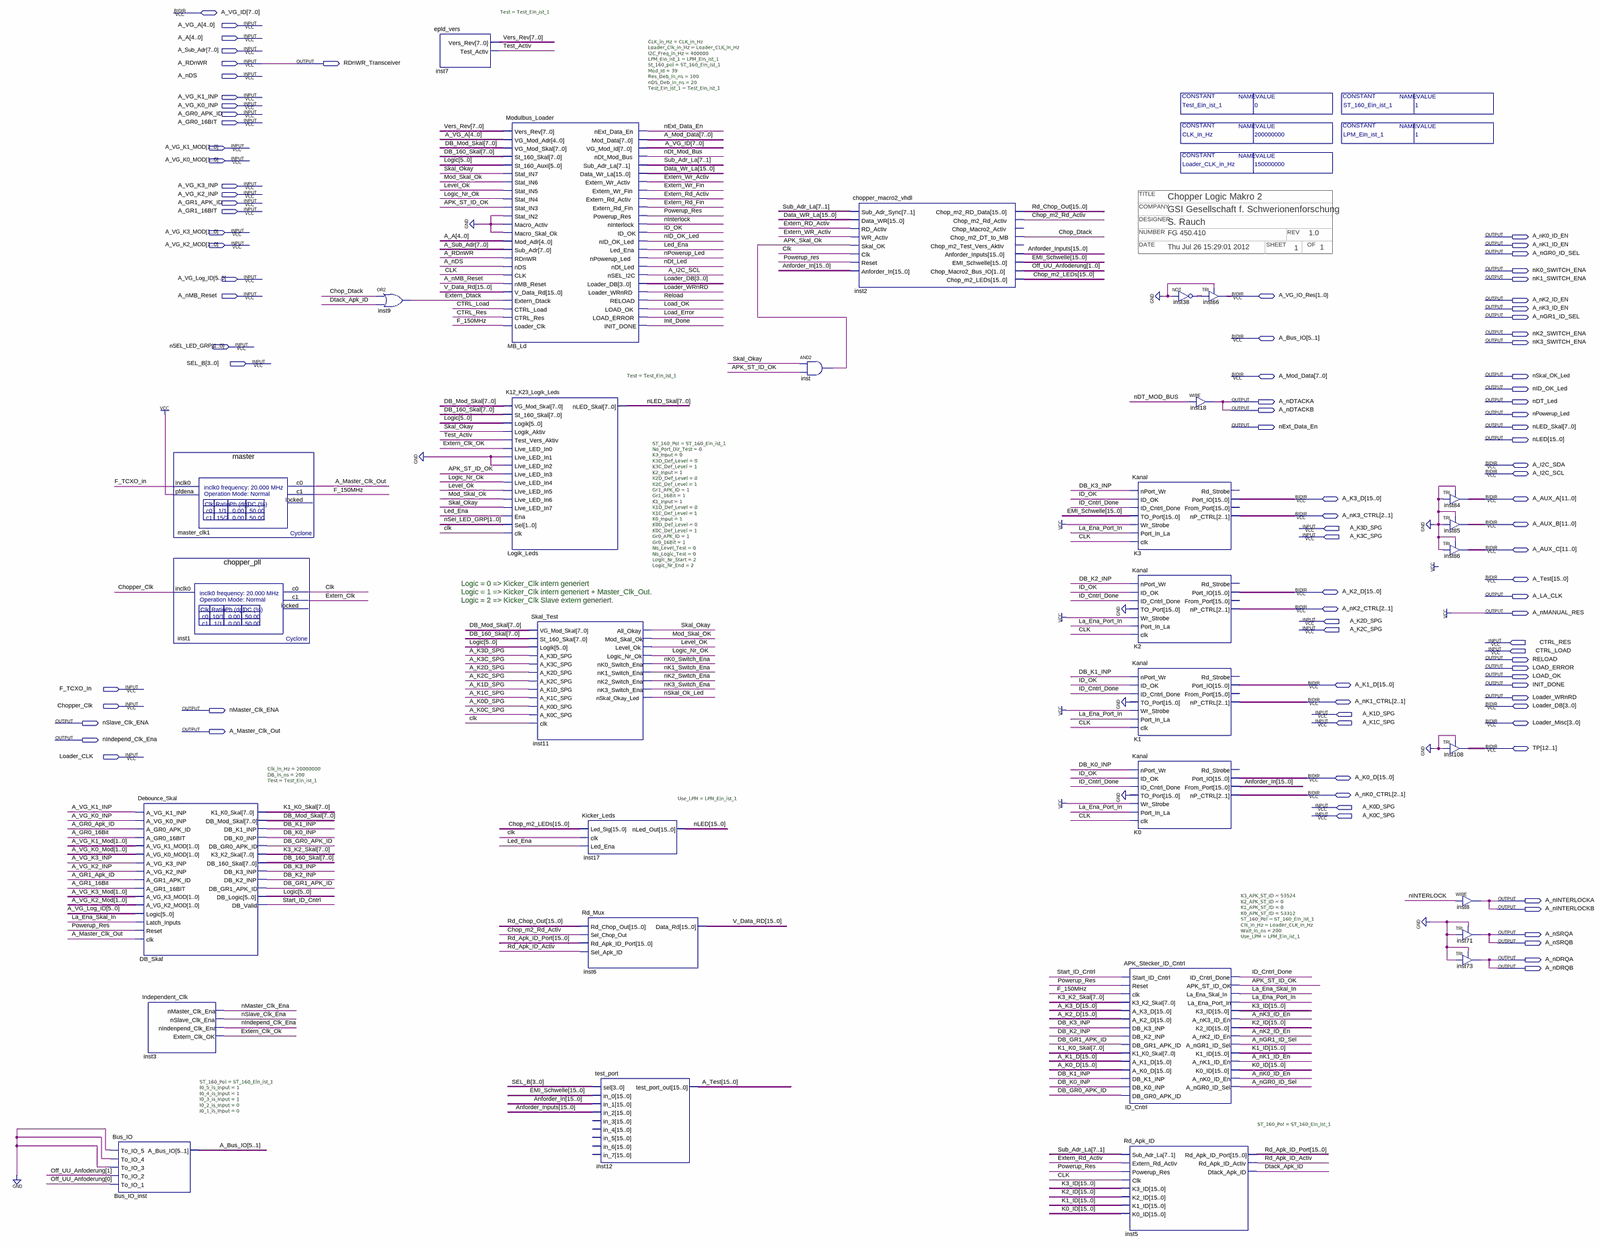
[diagram p0: schematic sheet, whole]
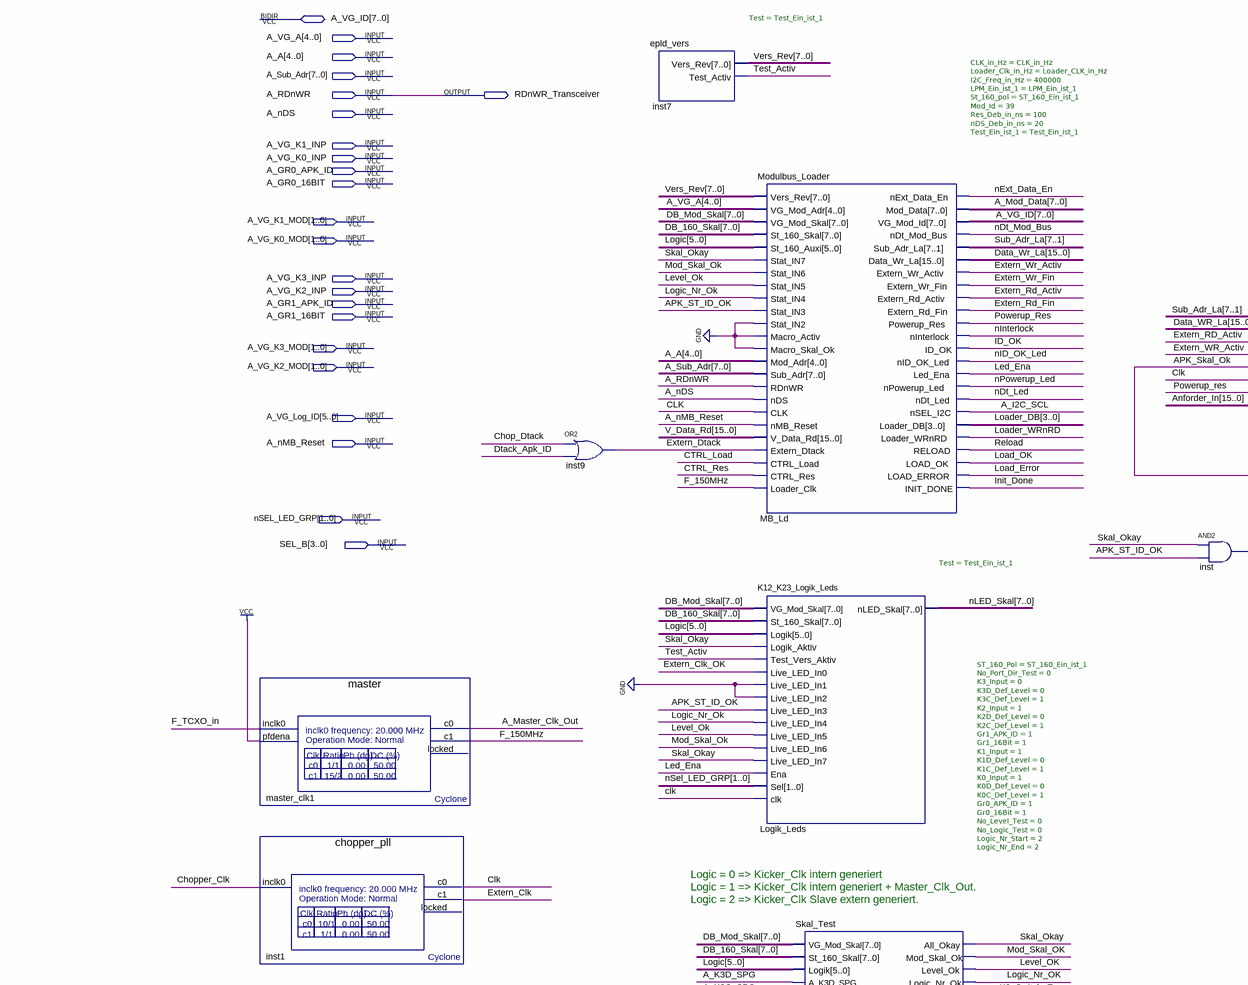
[diagram p1: schematic sheet, upper left part]
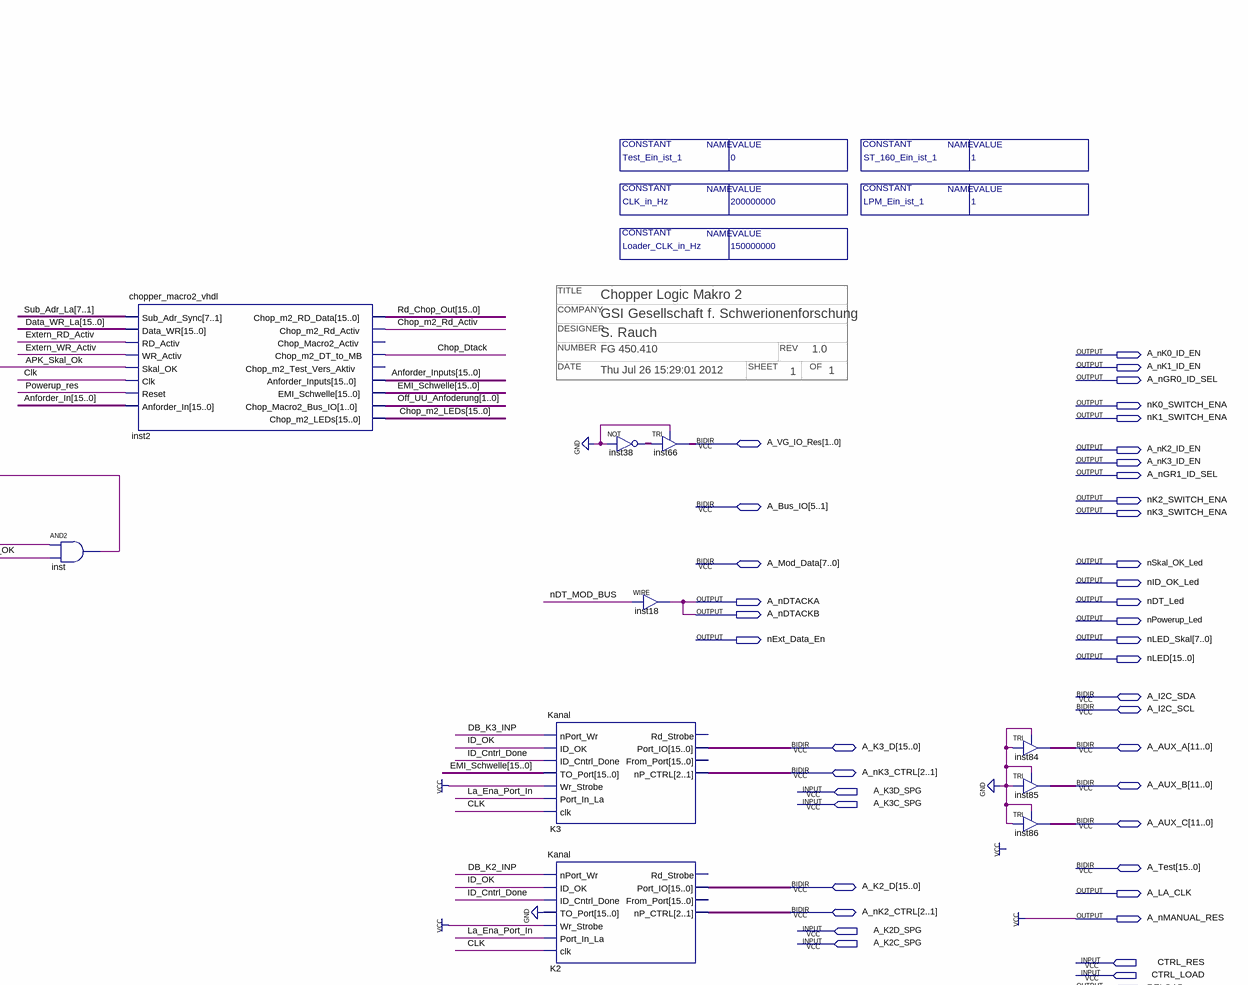
[diagram p2: schematic sheet, upper right part]
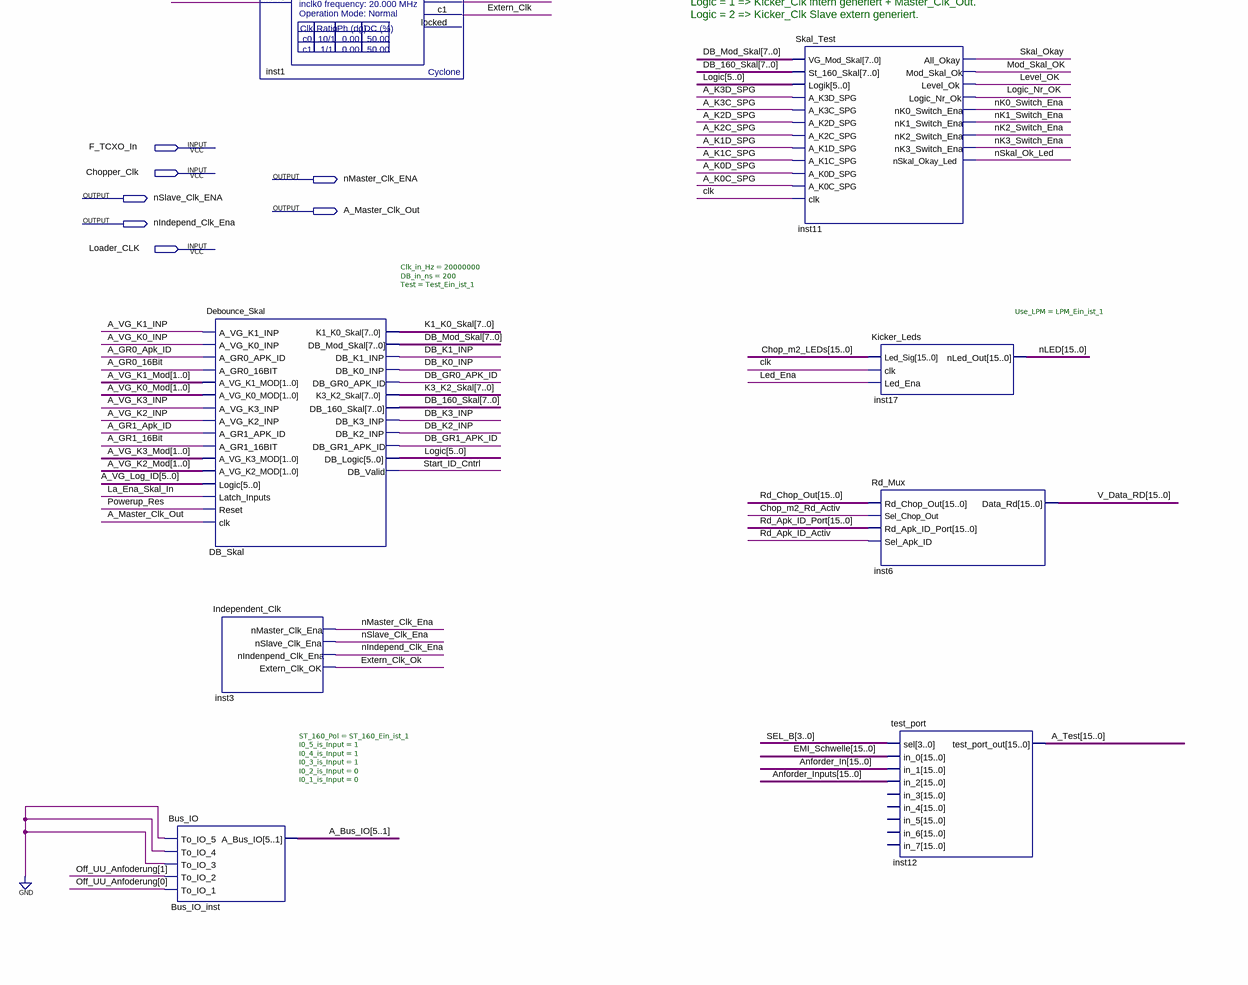
[diagram p3: schematic sheet, lower left part]
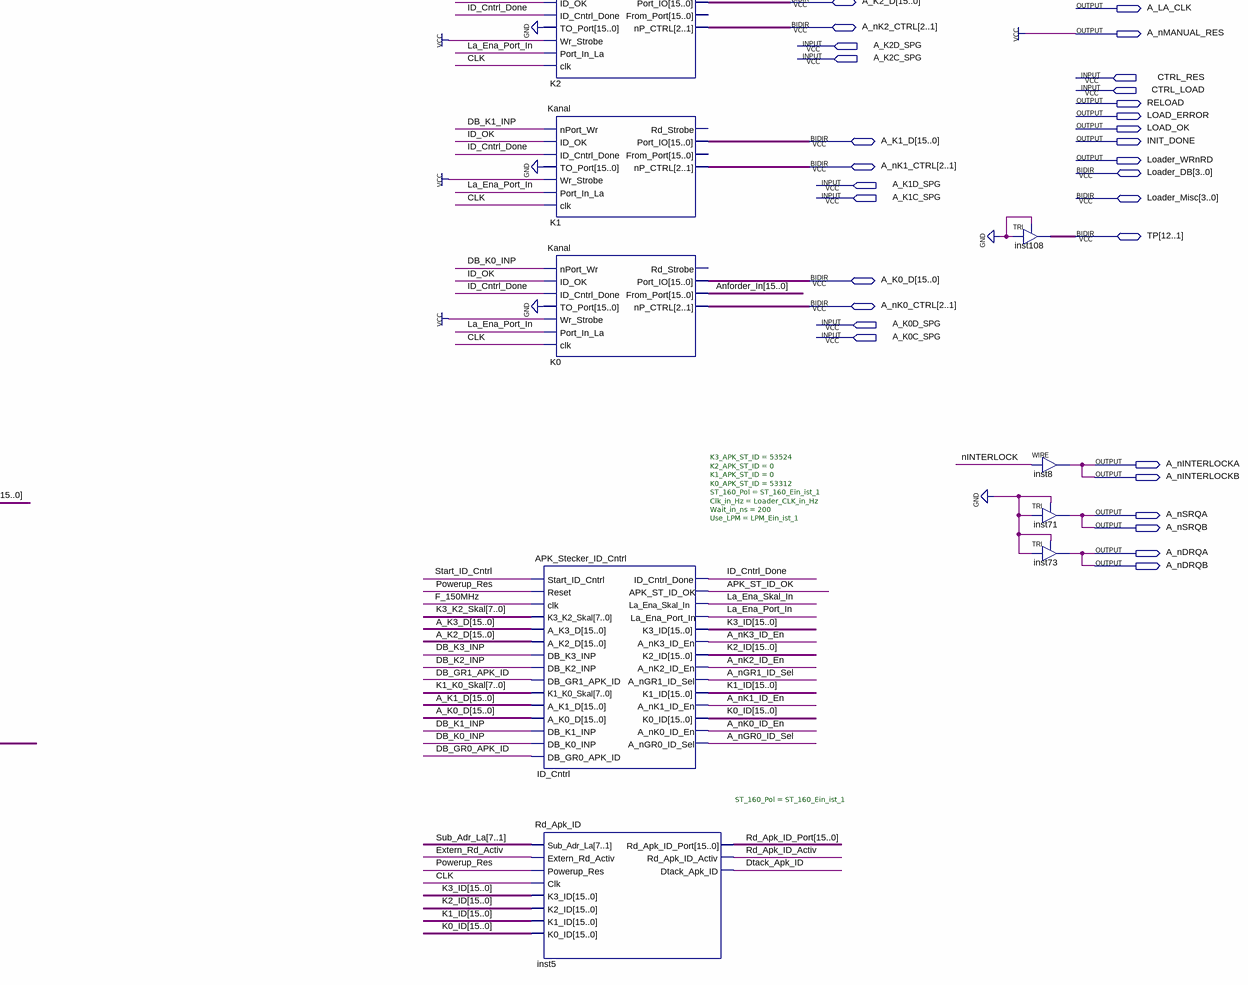
[diagram p4: schematic sheet, lower right part]
// Quartus schematic chopper_m2.bdf as structural Verilog: 31 symbols, 92 pins
// Title block: TITLE: Chopper Logic Makro 2; COMPANY: GSI Gesellschaft f. Schwerionenforschung; DESIGNER: S. Rauch; NUMBER: FG 450.410; REV: 1.0; DATE: Thu Jul 26 15:29:01 2012; SHEET: 1; OF: 1
module chopper_m2 #(parameter LPM_Ein_ist_1 = 1, parameter ST_160_Ein_ist_1 = 1, parameter Loader_CLK_in_Hz = 150000000, parameter CLK_in_Hz = 200000000, parameter Test_Ein_ist_1 = 0) (
  input  [4:0] A_VG_A,
  input  [4:0] A_A,
  input  [7:0] A_Sub_Adr,
  input  A_RDnWR,
  input  A_nDS,
  input  A_VG_K1_INP,
  input  A_VG_K0_INP,
  input  A_GR0_APK_ID,
  input  A_GR0_16BIT,
  input  [1:0] A_VG_K1_MOD,
  input  [1:0] A_VG_K0_MOD,
  input  A_VG_K3_INP,
  input  A_VG_K2_INP,
  input  A_GR1_APK_ID,
  input  A_GR1_16BIT,
  input  [1:0] A_VG_K3_MOD,
  input  [1:0] A_VG_K2_MOD,
  input  [5:0] A_VG_Log_ID,
  input  A_nMB_Reset,
  input  [1:0] nSEL_LED_GRP,
  input  [3:0] SEL_B,
  input  A_K3D_SPG,
  input  A_K3C_SPG,
  input  A_K2D_SPG,
  input  A_K2C_SPG,
  input  CTRL_RES,
  input  CTRL_LOAD,
  input  F_TCXO_In,
  input  Chopper_Clk,
  input  A_K1D_SPG,
  input  A_K1C_SPG,
  input  Loader_CLK,
  input  A_K0D_SPG,
  input  A_K0C_SPG,
  inout  [7:0] A_VG_ID,
  inout  [1:0] A_VG_IO_Res,
  inout  [5:1] A_Bus_IO,
  inout  [7:0] A_Mod_Data,
  inout  A_I2C_SDA,
  inout  A_I2C_SCL,
  inout  [15:0] A_K3_D,
  inout  [11:0] A_AUX_A,
  inout  [2:1] A_nK3_CTRL,
  inout  [11:0] A_AUX_B,
  inout  [11:0] A_AUX_C,
  inout  [15:0] A_Test,
  inout  [15:0] A_K2_D,
  inout  [2:1] A_nK2_CTRL,
  inout  [15:0] A_K1_D,
  inout  [2:1] A_nK1_CTRL,
  inout  [3:0] Loader_DB,
  inout  [3:0] Loader_Misc,
  inout  [12:1] TP,
  inout  [15:0] A_K0_D,
  inout  [2:1] A_nK0_CTRL,
  output RDnWR_Transceiver,
  output A_nK0_ID_EN,
  output A_nK1_ID_EN,
  output A_nGR0_ID_SEL,
  output nK0_SWITCH_ENA,
  output nK1_SWITCH_ENA,
  output A_nK2_ID_EN,
  output A_nK3_ID_EN,
  output A_nGR1_ID_SEL,
  output nK2_SWITCH_ENA,
  output nK3_SWITCH_ENA,
  output nSkal_OK_Led,
  output nID_OK_Led,
  output A_nDTACKA,
  output nDT_Led,
  output A_nDTACKB,
  output nPowerup_Led,
  output nExt_Data_En,
  output [7:0] nLED_Skal,
  output [15:0] nLED,
  output A_LA_CLK,
  output A_nMANUAL_RES,
  output RELOAD,
  output LOAD_ERROR,
  output LOAD_OK,
  output INIT_DONE,
  output Loader_WRnRD,
  output nMaster_Clk_ENA,
  output nSlave_Clk_ENA,
  output A_Master_Clk_Out,
  output nIndepend_Clk_Ena,
  output A_nINTERLOCKA,
  output A_nINTERLOCKB,
  output A_nSRQA,
  output A_nSRQB,
  output A_nDRQA,
  output A_nDRQB
);

  wire APK_Skal_Ok, APK_ST_ID_OK, Chop_Dtack, Chop_m2_Rd_Activ, CLK, DB_GR0_APK_ID, DB_GR1_APK_ID, DB_K0_INP,
       DB_K1_INP, DB_K2_INP, DB_K3_INP, Dtack_Apk_ID, Extern_Clk, Extern_Clk_OK, Extern_Dtack,
       Extern_Rd_Activ, Extern_Rd_Fin, Extern_Wr_Activ, Extern_Wr_Fin, F_150MHz, ID_Cntrl_Done, ID_OK,
       La_Ena_Port_In, La_Ena_Skal_In, Led_Ena, Level_Ok, Logic_Nr_Ok, Mod_Skal_Ok, nDt_Mod_Bus, nInterlock,
       Powerup_Res, Rd_Apk_ID_Activ, Skal_Okay, Start_ID_Cntrl, Test_Activ;
  wire [1:0] inst38_out, Off_UU_Anfoderung;
  wire [5:0] Logic;
  wire [7:0] DB_160_Skal, DB_Mod_Skal, K1_K0_Skal, K3_K2_Skal, Vers_Rev;
  wire [7:1] Sub_Adr_La;
  wire [15:0] Anforder_In, Anforder_Inputs, Chop_m2_LEDs, Data_Wr_La, EMI_Schwelle, K0_ID, K1_ID, K2_ID,
       K3_ID, Rd_Apk_ID_Port, Rd_Chop_Out, V_Data_Rd;

  Debounce_Skal #(.Clk_in_Hz(20000000), .DB_in_ns(200), .Test(Test_Ein_ist_1)) DB_Skal (
    .A_VG_K1_INP(A_VG_K1_INP), .A_VG_K0_INP(A_VG_K0_INP), .A_GR0_APK_ID(A_GR0_APK_ID),
    .A_GR0_16BIT(A_GR0_16BIT), .A_VG_K1_MOD(A_VG_K1_MOD), .A_VG_K0_MOD(A_VG_K0_MOD),
    .A_VG_K3_INP(A_VG_K3_INP), .A_VG_K2_INP(A_VG_K2_INP), .A_GR1_APK_ID(A_GR1_APK_ID),
    .A_GR1_16BIT(A_GR1_16BIT), .A_VG_K3_MOD(A_VG_K3_MOD), .A_VG_K2_MOD(A_VG_K2_MOD), .Logic(A_VG_Log_ID),
    .Latch_Inputs(La_Ena_Skal_In), .Reset(Powerup_Res), .clk(A_Master_Clk_Out), .K1_K0_Skal(K1_K0_Skal),
    .DB_Mod_Skal(DB_Mod_Skal), .DB_K1_INP(DB_K1_INP), .DB_K0_INP(DB_K0_INP), .DB_GR0_APK_ID(DB_GR0_APK_ID),
    .K3_K2_Skal(K3_K2_Skal), .DB_160_Skal(DB_160_Skal), .DB_K3_INP(DB_K3_INP), .DB_K2_INP(DB_K2_INP),
    .DB_GR1_APK_ID(DB_GR1_APK_ID), .DB_Logic(Logic), .DB_Valid(Start_ID_Cntrl));
  Independent_Clk inst3 (
    .nMaster_Clk_Ena(nMaster_Clk_ENA), .nSlave_Clk_Ena(nSlave_Clk_ENA),
    .nIndenpend_Clk_Ena(nIndepend_Clk_Ena), .Extern_Clk_OK(Extern_Clk_OK));
  Bus_IO #(.ST_160_Pol(ST_160_Ein_ist_1), .I0_5_is_Input(1), .I0_4_is_Input(1), .I0_3_is_Input(1), .I0_2_is_Input(0), .I0_1_is_Input(0)) Bus_IO_inst (
    .To_IO_5(1'b0), .To_IO_4(1'b0), .To_IO_3(1'b0), .To_IO_2(Off_UU_Anfoderung[1]),
    .To_IO_1(Off_UU_Anfoderung[0]), .A_Bus_IO(A_Bus_IO));
  master master_clk1 (.inclk0(F_TCXO_In), .pfdena(1'b1), .c0(A_Master_Clk_Out), .c1(F_150MHz));  // open: locked
  chopper_pll inst1 (.inclk0(Chopper_Clk), .c0(CLK), .c1(Extern_Clk));  // open: locked
  or inst9 (Extern_Dtack, Chop_Dtack, Dtack_Apk_ID);
  epld_vers #(.Test(Test_Ein_ist_1)) inst7 (.Vers_Rev(Vers_Rev), .Test_Activ(Test_Activ));
  Modulbus_Loader #(.CLK_in_Hz(CLK_in_Hz), .Loader_Clk_in_Hz(Loader_CLK_in_Hz), .I2C_Freq_in_Hz(400000), .LPM_Ein_ist_1(LPM_Ein_ist_1), .St_160_pol(ST_160_Ein_ist_1), .Mod_Id(39), .Res_Deb_in_ns(100), .nDS_Deb_in_ns(20), .Test_Ein_ist_1(Test_Ein_ist_1)) MB_Ld (
    .Vers_Rev(Vers_Rev), .VG_Mod_Adr(A_VG_A), .VG_Mod_Skal(DB_Mod_Skal), .St_160_Skal(DB_160_Skal),
    .St_160_Auxi(Logic), .Stat_IN7(Skal_Okay), .Stat_IN6(Mod_Skal_Ok), .Stat_IN5(Level_Ok),
    .Stat_IN4(Logic_Nr_Ok), .Stat_IN3(APK_ST_ID_OK), .Stat_IN2(1'b0), .Macro_Activ(1'b0),
    .Macro_Skal_Ok(1'b0), .Mod_Adr(A_A), .Sub_Adr(A_Sub_Adr), .RDnWR(A_RDnWR), .nDS(A_nDS), .CLK(CLK),
    .nMB_Reset(A_nMB_Reset), .V_Data_Rd(V_Data_Rd), .Extern_Dtack(Extern_Dtack), .CTRL_Load(CTRL_LOAD),
    .CTRL_Res(CTRL_RES), .Loader_Clk(F_150MHz), .nExt_Data_En(nExt_Data_En), .nDt_Mod_Bus(nDt_Mod_Bus),
    .Sub_Adr_La(Sub_Adr_La), .Data_Wr_La(Data_Wr_La), .Extern_Wr_Activ(Extern_Wr_Activ),
    .Extern_Wr_Fin(Extern_Wr_Fin), .Extern_Rd_Activ(Extern_Rd_Activ), .Extern_Rd_Fin(Extern_Rd_Fin),
    .Powerup_Res(Powerup_Res), .nInterlock(nInterlock), .ID_OK(ID_OK), .nID_OK_Led(nID_OK_Led),
    .Led_Ena(Led_Ena), .nPowerup_Led(nPowerup_Led), .nDt_Led(nDT_Led), .nSEL_I2C(A_I2C_SCL),
    .Loader_WRnRD(Loader_WRnRD), .RELOAD(RELOAD), .LOAD_OK(LOAD_OK), .LOAD_ERROR(LOAD_ERROR),
    .INIT_DONE(INIT_DONE), .Mod_Data(A_Mod_Data), .VG_Mod_Id(A_VG_ID), .Loader_DB(Loader_DB));
  K12_K23_Logik_Leds #(.Test(Test_Ein_ist_1)) Logik_Leds (
    .VG_Mod_Skal(DB_Mod_Skal), .St_160_Skal(DB_160_Skal), .Logik(Logic), .Logik_Aktiv(Skal_Okay),
    .Test_Vers_Aktiv(Test_Activ), .Live_LED_In0(Extern_Clk_OK), .Live_LED_In1(1'b0), .Live_LED_In2(1'b0),
    .Live_LED_In3(APK_ST_ID_OK), .Live_LED_In4(Logic_Nr_Ok), .Live_LED_In5(Level_Ok),
    .Live_LED_In6(Mod_Skal_Ok), .Live_LED_In7(Skal_Okay), .Ena(Led_Ena), .Sel(nSEL_LED_GRP), .clk(CLK),
    .nLED_Skal(nLED_Skal));
  Skal_Test #(.ST_160_Pol(ST_160_Ein_ist_1), .No_Port_Dir_Test(0), .K3_Input(0), .K3D_Def_Level(0), .K3C_Def_Level(1), .K2_Input(1), .K2D_Def_Level(0), .K2C_Def_Level(1), .Gr1_APK_ID(1), .Gr1_16Bit(1), .K1_Input(1), .K1D_Def_Level(0), .K1C_Def_Level(1), .K0_Input(1), .K0D_Def_Level(0), .K0C_Def_Level(1), .Gr0_APK_ID(1), .Gr0_16Bit(1), .No_Level_Test(0), .No_Logic_Test(0), .Logic_Nr_Start(2), .Logic_Nr_End(2)) inst11 (
    .VG_Mod_Skal(DB_Mod_Skal), .St_160_Skal(DB_160_Skal), .Logik(Logic), .A_K3D_SPG(A_K3D_SPG),
    .A_K3C_SPG(A_K3C_SPG), .A_K2D_SPG(A_K2D_SPG), .A_K2C_SPG(A_K2C_SPG), .A_K1D_SPG(A_K1D_SPG),
    .A_K1C_SPG(A_K1C_SPG), .A_K0D_SPG(A_K0D_SPG), .A_K0C_SPG(A_K0C_SPG), .clk(CLK), .All_Okay(Skal_Okay),
    .Mod_Skal_Ok(Mod_Skal_Ok), .Level_Ok(Level_Ok), .Logic_Nr_Ok(Logic_Nr_Ok),
    .nK0_Switch_Ena(nK0_SWITCH_ENA), .nK1_Switch_Ena(nK1_SWITCH_ENA), .nK2_Switch_Ena(nK2_SWITCH_ENA),
    .nK3_Switch_Ena(nK3_SWITCH_ENA), .nSkal_Okay_Led(nSkal_OK_Led));
  Kicker_Leds #(.Use_LPM(LPM_Ein_ist_1)) inst17 (.Led_Sig(Chop_m2_LEDs), .clk(CLK), .Led_Ena(Led_Ena), .nLed_Out(nLED));
  Rd_Mux inst6 (
    .Rd_Chop_Out(Rd_Chop_Out), .Sel_Chop_Out(Chop_m2_Rd_Activ), .Rd_Apk_ID_Port(Rd_Apk_ID_Port),
    .Sel_Apk_ID(Rd_Apk_ID_Activ), .Data_Rd(V_Data_Rd));
  test_port inst12 (
    .sel(SEL_B), .in_0(EMI_Schwelle), .in_1(Anforder_In), .in_2(Anforder_Inputs), .test_port_out(A_Test));  // open: in_3, in_4, in_5, in_6, in_7
  and inst (APK_Skal_Ok, Skal_Okay, APK_ST_ID_OK);
  chopper_macro2_vhdl inst2 (
    .Sub_Adr_Sync(Sub_Adr_La), .Data_WR(Data_Wr_La), .RD_Activ(Extern_Rd_Activ), .WR_Activ(Extern_Wr_Activ),
    .Skal_OK(APK_Skal_Ok), .Clk(CLK), .Reset(Powerup_Res), .Anforder_In(Anforder_In),
    .Chop_m2_RD_Data(Rd_Chop_Out), .Chop_m2_Rd_Activ(Chop_m2_Rd_Activ), .Chop_m2_DT_to_MB(Chop_Dtack),
    .Anforder_Inputs(Anforder_Inputs), .EMI_Schwelle(EMI_Schwelle), .Chop_Macro2_Bus_IO(Off_UU_Anfoderung),
    .Chop_m2_LEDs(Chop_m2_LEDs));  // open: Chop_Macro2_Activ, Chop_m2_Test_Vers_Aktiv
  APK_Stecker_ID_Cntrl #(.K3_APK_ST_ID(53524), .K2_APK_ST_ID(0), .K1_APK_ST_ID(0), .K0_APK_ST_ID(53312), .ST_160_Pol(ST_160_Ein_ist_1), .Clk_in_Hz(Loader_CLK_in_Hz), .Wait_in_ns(200), .Use_LPM(LPM_Ein_ist_1)) ID_Cntrl (
    .Start_ID_Cntrl(Start_ID_Cntrl), .Reset(Powerup_Res), .clk(F_150MHz), .K3_K2_Skal(K3_K2_Skal),
    .A_K3_D(A_K3_D), .A_K2_D(A_K2_D), .DB_K3_INP(DB_K3_INP), .DB_K2_INP(DB_K2_INP),
    .DB_GR1_APK_ID(DB_GR1_APK_ID), .K1_K0_Skal(K1_K0_Skal), .A_K1_D(A_K1_D), .A_K0_D(A_K0_D),
    .DB_K1_INP(DB_K1_INP), .DB_K0_INP(DB_K0_INP), .DB_GR0_APK_ID(DB_GR0_APK_ID),
    .ID_Cntrl_Done(ID_Cntrl_Done), .APK_ST_ID_OK(APK_ST_ID_OK), .La_Ena_Skal_In(La_Ena_Skal_In),
    .La_Ena_Port_In(La_Ena_Port_In), .K3_ID(K3_ID), .A_nK3_ID_En(A_nK3_ID_EN), .K2_ID(K2_ID),
    .A_nK2_ID_En(A_nK2_ID_EN), .A_nGR1_ID_Sel(A_nGR1_ID_SEL), .K1_ID(K1_ID), .A_nK1_ID_En(A_nK1_ID_EN),
    .K0_ID(K0_ID), .A_nK0_ID_En(A_nK0_ID_EN), .A_nGR0_ID_Sel(A_nGR0_ID_SEL));
  Rd_Apk_ID #(.ST_160_Pol(ST_160_Ein_ist_1)) inst5 (
    .Sub_Adr_La(Sub_Adr_La), .Extern_Rd_Activ(Extern_Rd_Activ), .Powerup_Res(Powerup_Res), .Clk(CLK),
    .K3_ID(K3_ID), .K2_ID(K2_ID), .K1_ID(K1_ID), .K0_ID(K0_ID), .Rd_Apk_ID_Port(Rd_Apk_ID_Port),
    .Rd_Apk_ID_Activ(Rd_Apk_ID_Activ), .Dtack_Apk_ID(Dtack_Apk_ID));
  Kanal K3 (
    .nPort_Wr(DB_K3_INP), .ID_OK(ID_OK), .ID_Cntrl_Done(ID_Cntrl_Done), .TO_Port(EMI_Schwelle),
    .Wr_Strobe(1'b1), .Port_In_La(La_Ena_Port_In), .clk(CLK), .Port_IO(A_K3_D), .nP_CTRL(A_nK3_CTRL));  // open: Rd_Strobe, From_Port
  Kanal K2 (
    .nPort_Wr(DB_K2_INP), .ID_OK(ID_OK), .ID_Cntrl_Done(ID_Cntrl_Done), .TO_Port({16{1'b0}}),
    .Wr_Strobe(1'b1), .Port_In_La(La_Ena_Port_In), .clk(CLK), .Port_IO(A_K2_D), .nP_CTRL(A_nK2_CTRL));  // open: Rd_Strobe, From_Port
  Kanal K1 (
    .nPort_Wr(DB_K1_INP), .ID_OK(ID_OK), .ID_Cntrl_Done(ID_Cntrl_Done), .TO_Port({16{1'b0}}),
    .Wr_Strobe(1'b1), .Port_In_La(La_Ena_Port_In), .clk(CLK), .Port_IO(A_K1_D), .nP_CTRL(A_nK1_CTRL));  // open: Rd_Strobe, From_Port
  Kanal K0 (
    .nPort_Wr(DB_K0_INP), .ID_OK(ID_OK), .ID_Cntrl_Done(ID_Cntrl_Done), .TO_Port({16{1'b0}}),
    .Wr_Strobe(1'b1), .Port_In_La(La_Ena_Port_In), .clk(CLK), .From_Port(Anforder_In), .Port_IO(A_K0_D),
    .nP_CTRL(A_nK0_CTRL));  // open: Rd_Strobe
  assign inst38_out = ~2'b00;  // NOT inst38, 2 bits wide
  assign A_nDTACKA = nDt_Mod_Bus;  // WIRE inst18
  TRI inst66[1:0] (.IN(inst38_out), .OE(1'b0), .OUT(A_VG_IO_Res));
  TRI inst84[11:0] (.IN(1'b0), .OE(1'b0), .OUT(A_AUX_A));
  TRI inst85[11:0] (.IN(1'b0), .OE(1'b0), .OUT(A_AUX_B));
  TRI inst86[11:0] (.IN(1'b0), .OE(1'b0), .OUT(A_AUX_C));
  TRI inst108[11:0] (.IN(1'b0), .OE(1'b0), .OUT(TP));
  assign A_nINTERLOCKA = nInterlock;  // WIRE inst8
  TRI inst71 (.IN(1'b0), .OE(1'b0), .OUT(A_nSRQA));
  TRI inst73 (.IN(1'b0), .OE(1'b0), .OUT(A_nDRQA));

  assign A_nDRQB = A_nDRQA;
  assign A_nDTACKB = A_nDTACKA;
  assign A_nINTERLOCKB = A_nINTERLOCKA;
  assign A_nMANUAL_RES = 1'b1;
  assign A_nSRQB = A_nSRQA;
  assign RDnWR_Transceiver = A_RDnWR;

  // Notes on the sheet:
  //   Logic = 0 => Kicker_Clk intern generiert
  //   Logic = 1 => Kicker_Clk intern generiert + Master_Clk_Out.
  //   Logic = 2 => Kicker_Clk Slave extern generiert.
endmodule
